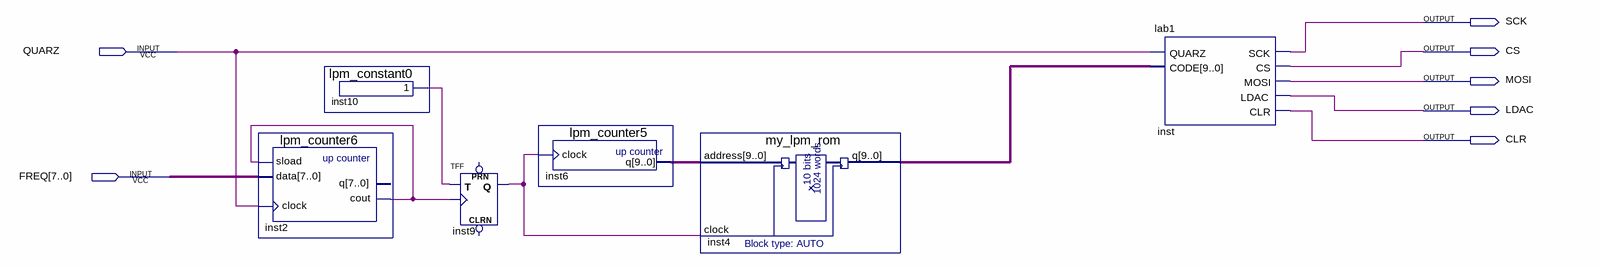
[diagram p0: schematic sheet]
// Quartus schematic sinus.bdf as structural Verilog: 6 symbols, 7 pins
module sinus (
  input  QUARZ,
  input  [7:0] FREQ,
  output SCK,
  output CS,
  output MOSI,
  output LDAC,
  output CLR
);

  wire inst2_cout, inst9_q, inst10_result;
  wire [9:0] inst4_q, inst6_q;

  lpm_counter6 inst2 (.sload(inst2_cout), .data(FREQ), .clock(QUARZ), .cout(inst2_cout));  // open: q
  lpm_constant0 inst10 (.result(inst10_result));
  TFF inst9 (.T(inst10_result), .CLK(inst2_cout), .Q(inst9_q));  // open: PRN, CLRN
  lpm_counter5 inst6 (.clock(inst9_q), .q(inst6_q));
  my_lpm_rom inst4 (.address(inst6_q), .clock(inst9_q), .q(inst4_q));
  lab1 inst (.QUARZ(QUARZ), .CODE(inst4_q), .SCK(SCK), .CS(CS), .MOSI(MOSI), .LDAC(LDAC), .CLR(CLR));
endmodule
